# EAGLE schematic Stepper_motor (EAGLE 9.6.2)
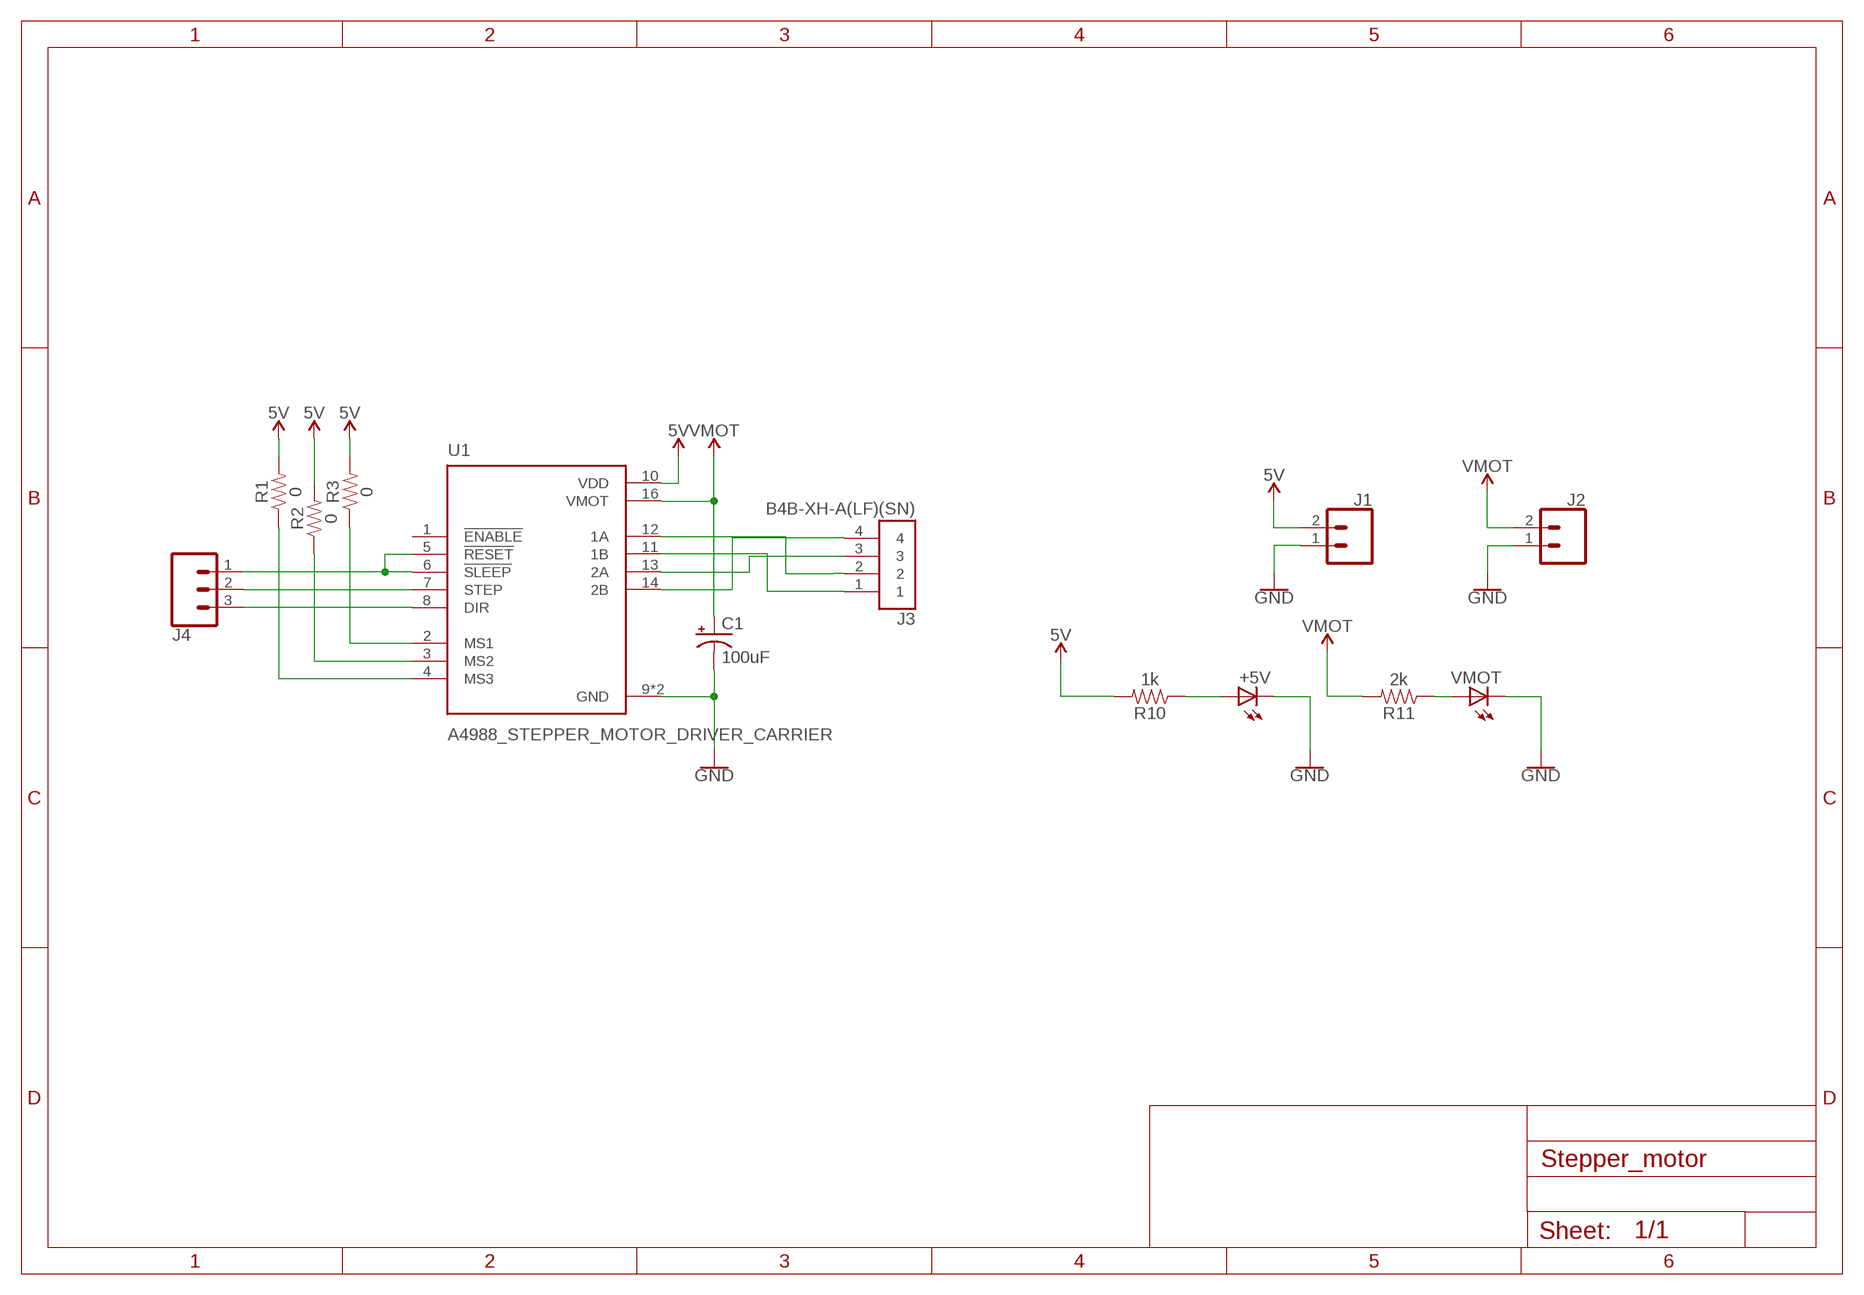
[diagram p0: schematic, sheet 1]

## Parts
+5V  LEDP-LCC-2  [P-LCC-2]
C1  100uF  100UF-POLAR-25V-20%(ELEC)  [PANASONIC_D]
J1  CONN_025MM  [SCREWTERMINAL-5MM-2]
J2  CONN_025MM  [SCREWTERMINAL-5MM-2]
J3  B4B-XH-A(LF)(SN)  [JST_B4B-XH-A(LF)(SN)]
J4  CONN_03SCREW  [SCREWTERMINAL-3.5MM-3]
R1  0  RESISTOR1206  [1206]
R2  0  RESISTOR1206  [1206]
R3  0  RESISTOR1206  [1206]
R10  1k  RESISTOR1206  [1206]
R11  2k  RESISTOR1206  [1206]
U1  A4988_STEPPER_MOTOR_DRIVER_CARRIER  [MODULE_A4988_STEPPER_MOTOR_DRIVER_CARRIER]
VMOT  LEDP-LCC-2  [P-LCC-2]

## Nets
5V: J1.2 R1.2 R2.2 R3.2 R10.2 U1.10(VDD)
12V: C1.+ J2.2 R11.2 U1.16(VMOT) ; supply symbol labelled VMOT
GND: +5V.C C1.- J1.1 J2.1 U1.9(GND) U1.15(GND) VMOT.C
N$1: J3.1 U1.11(1B)
N$2: J3.2 U1.12(1A)
N$3: J3.3 U1.13(2A)
N$4: J3.4 U1.14(2B)
N$5: J4.2 U1.7(STEP)
N$6: J4.3 U1.8(DIR)
N$7: J4.1 U1.5(!RESET) U1.6(!SLEEP)
N$8: R3.1 U1.2(MS1)
N$9: R2.1 U1.3(MS2)
N$10: R1.1 U1.4(MS3)
N$11: +5V.A R10.1
N$12: R11.1 VMOT.A
Unconnected: U1.1(!ENABLE)

## Library data of the parts
+5V VMOT = adafruit:LED: LED OSRAM: - CHIPLED LG R971, LG N971, LY N971, LG Q971, LY Q971, LO R971, LY R971 LH N974, LH R974 LS Q976, LO Q976, LY Q976 LO Q996 - Hyper CHIPLED LW Q18S LB Q993, LB Q99A, LB R99A - SideLED LS A670, LO A670, LY A670, LG A670, LP A670 LB A673, LV A673, LT A673, LW A673 LH A674 LY A675 LS A676, LA A676, LO A676, LY A676, LW A676 LS A679, LY A679, LG A679 - Hyper Micro SIDELED® LS Y876, LA Y876, LO Y876, LY Y876 LT Y87S - SmartLED LW L88C, LW L88S LB L89C, LB L89S, LG L890 LS L89K, LO L89K, LY L89K LS L896, LA L896, LO L896, LY L896 - TOPLED LS T670, LO T670, LY T670, LG T670, LP T670 LSG T670, LSP T670, LSY T670, LOP T670, LYG T670 LG T671, LOG T671, LSG T671 LB T673, LV T673, LT T673, LW T673 LH T674 LS T676, LA T676, LO T676, LY T676, LB T676, LH T676, LSB T676, LW T676 LB T67C, LV T67C, LT T67C, LS T67K, LO T67K, LY T67K, LW E67C LS E67B, LA E67B, LO E67B, LY E67B, LB E67C, LV E67C, LT E67C LW T67C LS T679, LY T679, LG T679 LS T770, LO T770, LY T770, LG T770, LP T770 LB T773, LV T773, LT T773, LW T773 LH T774 LS E675, LA E675, LY E675, LS T675 LS T776, LA T776, LO T776, LY T776, LB T776 LHGB T686 LT T68C, LB T68C - Hyper Mini TOPLED® LB M676 - Mini TOPLED Santana® LG M470 LS M47K, LO M47K, LY M47K Source: http://www.osram.convergy.de/
C1 = SparkFun-Capacitors:100UF-POLAR: 100µF polarized capacitors A capacitor is a passive two-terminal electrical component used to store electrical energy temporarily in an electric field.; PROD_ID: CAP-12547
J1 J2 = SparkFun-Connectors:CONN_02: Multi connection point. Often used as Generic Header-pin footprint for 0.1 inch spaced/style header connections On any of the 0.1 inch spaced packages, you can populate with these: Break Away Headers - Straight <https://www.sparkfun.com/products/116> (PRT-00116) Break Away Male Headers - Right Angle <https://www.sparkfun.com/products/553> (PRT-00553) Female Headers <https://www.sparkfun.com/products/115> (PRT-00115) Break Away Headers - Machine Pin <https://www.sparkfun.com/products/117> (PRT-00117) Break Away Female Headers - Swiss Machine Pin <https://www.sparkfun.com/products/743> (PRT-00743) For SCREWTERMINALS and SPRING TERMINALS visit here: Screw Terimnals on SparkFun.com <https://www.sparkfun.com/search/results?term=Screw+Terminals> (5mm/3.5mm/2.54mm spacing) This device is also useful as a general connection point to wire up your design to another part of your project. Our various solder wires solder well into these plated through hole pads. Hook-Up Wire - Assortment (Stranded, 22 AWG) <https://www.sparkfun.com/products/11375> (PRT-11375) Hook-Up Wire - Assortment (Solid Core, 22 AWG) <https://www.sparkfun.com/products/11367> (PRT-11367) View the entire wire category on our website here <https://www.sparkfun.com/categories/141> Special notes: Molex polarized connector foot print use with: PRT-08233 with associated crimp pins and housings. 2.54_SCREWTERM for use with PRT-10571. 3.5mm Screw Terminal footprints for PRT-08084 5mm Screw Terminal footprints for use with PRT-08432; SF_SKU: PRT-08432
J3 = B4B-XH-A_LF__SN_:B4B-XH-A(LF)(SN): XH Series 4 Position 2.5 mm Pitch Through Hole Crimp Top Entry Shrouded Header Check prices <https://pricing.snapeda.com/parts/B4B-XH-A%28LF%29%28SN%29/JST%20Sales/view-part?ref=eda>; AVAILABILITY: Warning; DESCRIPTION: Connector Header Through Hole 4 position 0.098 (2.50mm); MF: JST Sales; MP: B4B-XH-A(LF)(SN); PACKAGE: None; PRICE: None; PURCHASE-URL: https://pricing.snapeda.com/search/part/B4B-XH-A(LF)(SN)/?ref=eda
J4 = SparkFun-Connectors:CONN_03: Multi connection point. Often used as Generic Header-pin footprint for 0.1 inch spaced/style header connections On any of the 0.1 inch spaced packages, you can populate with these: Break Away Headers - Straight <https://www.sparkfun.com/products/116> (PRT-00116) Break Away Male Headers - Right Angle <https://www.sparkfun.com/products/553> (PRT-00553) Female Headers <https://www.sparkfun.com/products/115> (PRT-00115) Break Away Headers - Machine Pin <https://www.sparkfun.com/products/117> (PRT-00117) Break Away Female Headers - Swiss Machine Pin <https://www.sparkfun.com/products/743> (PRT-00743) Stackable Header - 3 Pin (Female, 0.1") <https://www.sparkfun.com/products/13875> (PRT-13875) For SCREWTERMINALS and SPRING TERMINALS visit here: Screw Terimnals on SparkFun.com <https://www.sparkfun.com/search/results?term=Screw+Terminals> (5mm/3.5mm/2.54mm spacing) This device is also useful as a general connection point to wire up your design to another part of your project. Our various solder wires solder well into these plated through hole pads. Hook-Up Wire - Assortment (Stranded, 22 AWG) <https://www.sparkfun.com/products/11375> (PRT-11375) Hook-Up Wire - Assortment (Solid Core, 22 AWG) <https://www.sparkfun.com/products/11367> (PRT-11367) View the entire wire category on our website here <https://www.sparkfun.com/categories/141> Special notes: Molex polarized connector foot print use with SKU : PRT-08232 with associated crimp pins and housings.; PROD_ID: CONN-08288; SF_ID: PRT-08235
R1-R3 R10 R11 = SparkFun-Resistors:RESISTOR: Generic Resistor Package
U1 = A4988_STEPPER_MOTOR_DRIVER_CARRIER:A4988_STEPPER_MOTOR_DRIVER_CARRIER: Stepper motor controler; IC: A4988; 1A; Uin mot: 8÷35V; AVAILABILITY: Unavailable; DESCRIPTION: Stepper Motor Driver; MF: Pololu; MP: A4988 STEPPER MOTOR DRIVER CARRIER; PACKAGE: None; PRICE: None